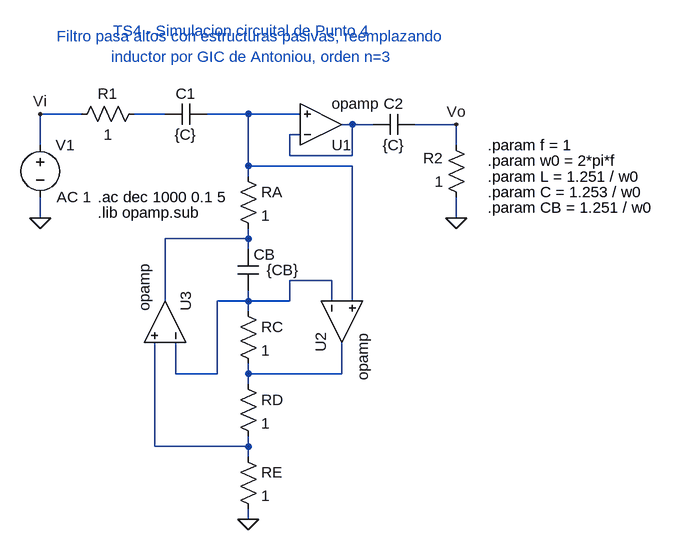
[diagram p0: schematic TS4_Albanesi_Punto4Spice.asc]
TS4_Albanesi_Punto4Spice.asc, the LTspice schematic file:
Version 4
SHEET 1 1036 744
WIRE -48 96 -112 96
WIRE 80 96 32 96
WIRE 208 96 144 96
WIRE 288 96 208 96
WIRE 368 112 352 112
WIRE 400 112 368 112
WIRE 528 112 464 112
WIRE 288 128 272 128
WIRE -112 144 -112 96
WIRE 528 144 528 112
WIRE 272 160 272 128
WIRE 368 160 368 112
WIRE 368 160 272 160
WIRE 208 176 208 96
WIRE 368 176 208 176
WIRE 208 192 208 176
WIRE -112 256 -112 224
WIRE 528 256 528 224
WIRE 208 288 208 272
WIRE 208 288 80 288
WIRE 208 304 208 288
WIRE 336 352 272 352
WIRE 80 384 80 288
WIRE 208 384 208 368
WIRE 208 384 160 384
WIRE 272 384 272 352
WIRE 272 384 208 384
WIRE 336 384 336 352
WIRE 368 384 368 176
WIRE 208 400 208 384
WIRE 96 496 96 448
WIRE 160 496 160 384
WIRE 160 496 96 496
WIRE 208 496 208 480
WIRE 352 496 352 448
WIRE 352 496 208 496
WIRE 208 512 208 496
WIRE 64 608 64 448
WIRE 208 608 208 592
WIRE 208 608 64 608
WIRE 208 624 208 608
WIRE 208 720 208 704
FLAG 528 256 0
FLAG -112 256 0
FLAG -112 96 Vi
FLAG 528 112 Vo
FLAG 208 720 0
SYMBOL res 48 80 R90
WINDOW 0 0 56 VBottom 2
WINDOW 3 32 56 VTop 2
SYMATTR InstName R1
SYMATTR Value 1
SYMBOL res 544 240 R180
WINDOW 0 36 76 Left 2
WINDOW 3 36 40 Left 2
SYMATTR InstName R2
SYMATTR Value 1
SYMBOL cap 144 80 R90
WINDOW 0 0 32 VBottom 2
WINDOW 3 32 32 VTop 2
SYMATTR InstName C1
SYMATTR Value {C}
SYMBOL cap 464 96 R90
WINDOW 0 0 32 VBottom 2
WINDOW 3 32 32 VTop 2
SYMATTR InstName C2
SYMATTR Value {C}
SYMBOL OpAmps\\opamp 320 176 M180
SYMATTR InstName U1
SYMBOL voltage -112 128 R0
WINDOW 123 25 96 Left 2
WINDOW 39 0 0 Left 0
SYMATTR InstName V1
SYMATTR Value ""
SYMATTR Value2 AC 1
SYMBOL res 192 176 R0
SYMATTR InstName RA
SYMATTR Value 1
SYMBOL res 192 384 R0
SYMATTR InstName RC
SYMATTR Value 1
SYMBOL res 192 496 R0
SYMATTR InstName RD
SYMATTR Value 1
SYMBOL res 192 608 R0
SYMATTR InstName RE
SYMATTR Value 1
SYMBOL cap 192 304 R0
WINDOW 3 44 32 Left 2
SYMATTR InstName CB
SYMATTR Value {CB}
SYMBOL OpAmps\\opamp 288 416 M90
SYMATTR InstName U2
SYMBOL OpAmps\\opamp 144 416 M270
SYMATTR InstName U3
TEXT -24 248 Left 2 !.lib opamp.sub
TEXT 0 -32 Left 2 ;TS4 - Simulacion circuital de Punto 4
TEXT 216 -8 Center 2 ;Filtro pasa altos con estructuras pasivas, reemplazando \ninductor por GIC de Antoniou, orden n=3
TEXT -24 224 Left 2 !.ac dec 1000 0.1 5
TEXT 576 144 Left 2 !.param f = 1
TEXT 576 168 Left 2 !.param w0 = 2*pi*f
TEXT 576 192 Left 2 !.param L = 1.251 / w0
TEXT 576 216 Left 2 !.param C = 1.253 / w0
TEXT 576 240 Left 2 !.param CB = 1.251 / w0

The netlist it stands for:
* TS4_Albanesi_Punto4Spice.asc
R1 N001 Vi 1
R2 0 Vo 1
C1 N002 N001 {C}
C2 Vo N003 {C}
XU1 N003 N002 N003 opamp Aol=100K GBW=10Meg  ; pins invin noninvin out
V1 Vi 0 AC 1
RA N002 N004 1
RC N005 N006 1
RD N006 N007 1
RE N007 0 1
CB N004 N005 {CB}
XU2 N005 N002 N006 opamp Aol=100K GBW=10Meg  ; pins invin noninvin out
XU3 N005 N007 N004 opamp Aol=100K GBW=10Meg  ; pins invin noninvin out
.lib opamp.sub
* TS4 - Simulacion circuital de Punto 4
* Filtro pasa altos con estructuras pasivas, reemplazando
* inductor por GIC de Antoniou, orden n=3
.ac dec 1000 0.1 5
.param f = 1
.param w0 = 2*pi*f
.param L = 1.251 / w0
.param C = 1.253 / w0
.param CB = 1.251 / w0
.backanno
.end

* Results of the author's LTspice run, read from the files saved beside the schematic
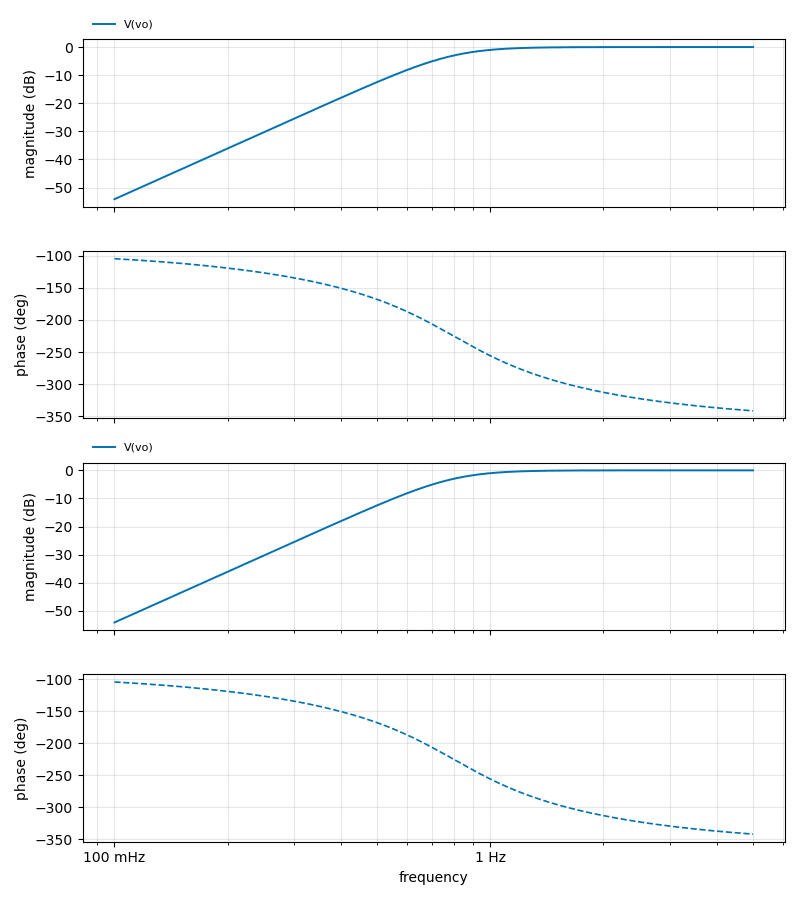
[diagram p1: AC Analysis of TS4_Albanesi_Punto4Spice.asc, plotted from the saved traces]
* AC Analysis, 1 run:
*   V(vo): -54.14 dB at 100 mHz, -0.00 dB at 5 Hz, peak -0.00 dB at 5 Hz, 3 dB below the peak at 798.9 mHz
*   V(vo): -54.14 dB at 100 mHz, -0.00 dB at 5 Hz, peak -0.00 dB at 5 Hz, 3 dB below the peak at 798.9 mHz